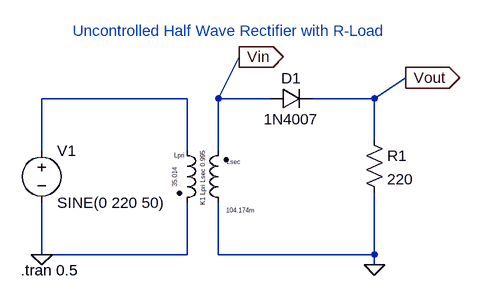
[diagram p0: schematic RLoad.asc]
RLoad.asc, the LTspice schematic file:
Version 4
SHEET 1 1396 680
WIRE -16 256 -240 256
WIRE 32 256 64 192
WIRE 112 256 32 256
WIRE 272 256 320 224
WIRE 272 256 176 256
WIRE 272 320 272 256
WIRE -240 336 -240 256
WIRE -16 336 -16 256
WIRE 32 336 32 256
WIRE -240 496 -240 416
WIRE -16 496 -16 416
WIRE -16 496 -240 496
WIRE 32 496 32 416
WIRE 272 496 272 400
WIRE 272 496 32 496
WIRE 272 512 272 496
FLAG 320 224 Vout
IOPIN 320 224 Out
FLAG -240 496 0
FLAG 64 192 Vin
IOPIN 64 192 Out
FLAG 272 512 0
DATAFLAG 48 224 ""
SYMBOL voltage -240 320 R0
WINDOW 123 0 0 Left 0
WINDOW 39 0 0 Left 0
SYMATTR InstName V1
SYMATTR Value SINE(0 220 50)
SYMBOL ind2 -32 320 R0
WINDOW 0 -4 23 Left 0
WINDOW 3 -3 72 VLeft 0
SYMATTR InstName Lpri
SYMATTR Value 35.014
SYMATTR Type ind
SYMATTR SpiceLine Rser=0.5
SYMBOL diode 112 272 R270
WINDOW 0 32 32 VTop 2
WINDOW 3 0 32 VBottom 2
SYMATTR InstName D1
SYMATTR Value 1N4007
SYMBOL res 256 304 R0
SYMATTR InstName R1
SYMATTR Value 220
SYMBOL ind2 48 432 R180
WINDOW 0 -18 79 Left 0
WINDOW 3 -41 4 Left 0
SYMATTR InstName Lsec
SYMATTR Value 104.174m
SYMATTR Type ind
SYMATTR SpiceLine Rser=0.1
TEXT -272 520 Left 2 !.tran 0.5
TEXT 8 336 VRight 0 !K1 Lpri Lsec 0.995
TEXT -192 152 Left 2 ;Uncontrolled Half Wave Rectifier with R-Load

The netlist it stands for:
* RLoad.asc
V1 N001 0 SINE(0 220 50)
Lpri N001 0 35.014 Rser=0.5
D1 Vin Vout 1N4007
R1 Vout 0 220
Lsec 0 Vin 104.174m Rser=0.1
.model D D
.lib standard.dio
.tran 0.5
K1 Lpri Lsec 0.995
* Uncontrolled Half Wave Rectifier with R-Load
.backanno
.end